# Altium schematic sheet Power.SchDoc
size A4
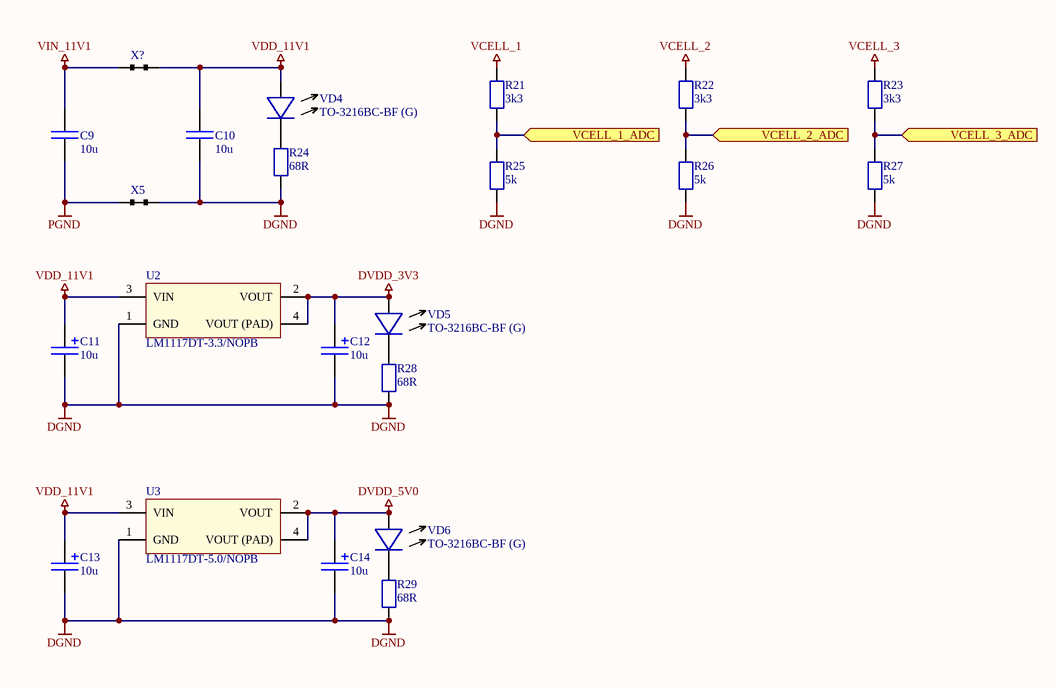
[diagram p0: Power.SchDoc]

## Parts
C9  10u  [C_1206/3216]
C10  10u  [C_1206/3216]
C11  10u  [TECAP_TYPE_C]
C12  10u  [TECAP_TYPE_B]
C13  10u  [TECAP_TYPE_C]
C14  10u  [TECAP_TYPE_B]
R21  3k3  [R_0603/1608]
R22  3k3  [R_0603/1608]
R23  3k3  [R_0603/1608]
R24  68R  [R_0603/1608]
R25  5k  [R_0603/1608]
R26  5k  [R_0603/1608]
R27  5k  [R_0603/1608]
R28  68R  [R_0603/1608]
R29  68R  [R_0603/1608]
U2  LM1117DT-3.3/NOPB  [TO252AA/DPAK]
U3  LM1117DT-5.0/NOPB  [TO252AA/DPAK]
VD4  TO-3216BC-BF (G)  [LED_0603/1608]
VD5  TO-3216BC-BF (G)  [LED_0603/1608]
VD6  TO-3216BC-BF (G)  [LED_0603/1608]
X5  (no value)  [NET_TIE_1.0]  (net tie, no BOM)
X?  (no value)  [NET_TIE_1.0]  (net tie, no BOM)

## Ports
VCELL_1_ADC, VCELL_2_ADC, VCELL_3_ADC

## Nets
DGND: C10.1 C11.2(NEG) C12.2(NEG) C13.2(NEG) C14.2(NEG) R24.1 R25.1 R26.1 R27.1 R28.1 R29.1 U2.1(GND) U3.1(GND) X5.2
DVDD_3V3: C12.1(POS) U2.2(VOUT) U2.4(VOUT_(PAD)) VD5.A(Anode)
DVDD_5V0: C14.1(POS) U3.2(VOUT) U3.4(VOUT_(PAD)) VD6.A(Anode)
PGND: C9.1 X5.1
VCELL_1: R21.2
VCELL_2: R22.2
VCELL_3: R23.2
VDD_11V1: C10.2 C11.1(POS) C13.1(POS) U2.3(VIN) U3.3(VIN) VD4.A(Anode) X?.2
VIN_11V1: C9.2 X?.1
VCELL_1_ADC: R21.1 R25.2 ; port VCELL_1_ADC
VCELL_2_ADC: R22.1 R26.2 ; port VCELL_2_ADC
VCELL_3_ADC: R23.1 R27.2 ; port VCELL_3_ADC
NetR24_2: R24.2 VD4.C(Cathode)
NetR28_2: R28.2 VD5.C(Cathode)
NetR29_2: R29.2 VD6.C(Cathode)

## Library data of the parts
C9 C10 = Capacitor: Non-polarized capacitor
C11-C14 = Capacitor polar: Polarized capacitor
R21-R29 = Resistor
U2 U3 = LM1117: LDO voltage regulator; pin to pad: 2>3 3>2 4>3
VD4-VD6 = LED
X5 X? = Net tie